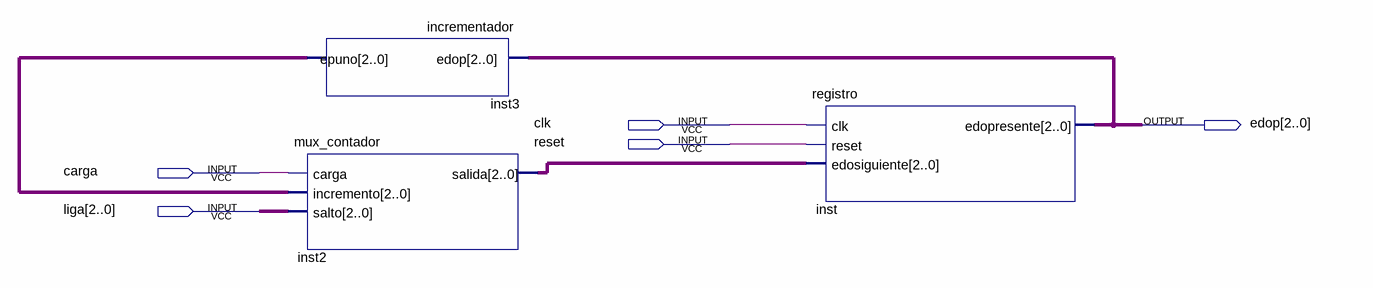
[diagram p0: schematic sheet]
// Quartus schematic contador.bdf as structural Verilog: 3 symbols, 5 pins
module contador (
  input  clk,
  input  reset,
  input  carga,
  input  [2:0] liga,
  output [2:0] edop
);

  wire [2:0] inst2_salida, inst3_epuno;

  incrementador inst3 (.edop(edop), .epuno(inst3_epuno));
  mux_contador inst2 (.carga(carga), .incremento(inst3_epuno), .salto(liga), .salida(inst2_salida));
  registro inst (.clk(clk), .reset(reset), .edosiguiente(inst2_salida), .edopresente(edop));
endmodule
